# Altium project Venato.PrjPcb (part 2 of 3)
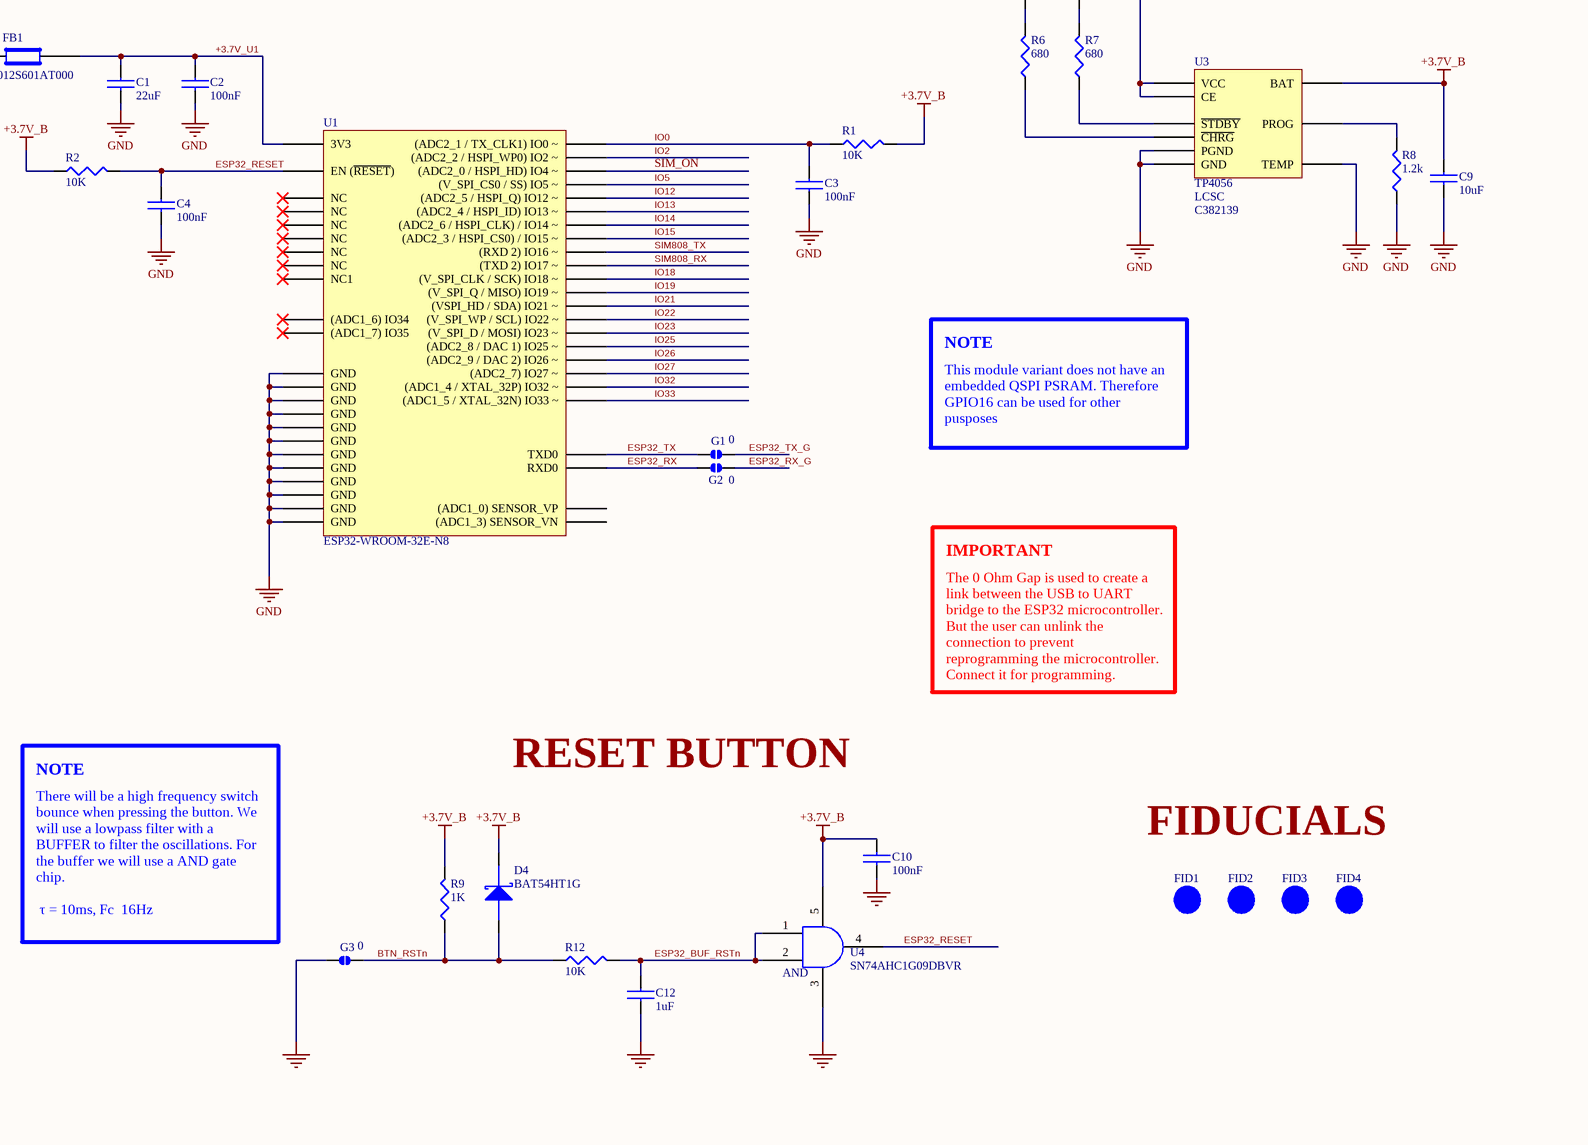
[diagram p4: Venato_Schematic_v1.SchDoc, bottom right]

## Sheet Venato_Schematic_v1.SchDoc (continued)
### Library data of the parts
ANT1 ANT2 = W3043: Antenna Ceramic Monopole 4dB Gain 2483.5MHz SMD; Manufacturer: Pulse; Max Frequency: 2.4835GHz; Number of Bands: 2; Return Loss: -12dB; Impedance: 50R; Manufacturer Part Number: W3043; RoHS: Yes; Category: RF Antennas; Stock 1: 1794; Pricing 1: 1=1.59000, 10=1.43100, 25=1.35000, 100=1.15020, 250=1.08000, 500=0.94500, 1000=0.78300 (USD); Mount: Surface Mount; Case/Package: SMD/SMT; Min Operating Temperature: -40°C; Max Operating Temperature: 85°C; Packaging: Bulk; Package Quantity: 3000; Termination: Solder; Resistor Type: Ceramic; Length: 1.6mm; Width: 3.2mm; Height: 0.043inch; ComponentLink1URL: https://datasheet.ciiva.com/8153/+w3043-8153043.pdf?src-supplier=Avnet; ComponentLink1Description: https://datasheet.ciiva.com/8153/+w3043-8153043.pdf?src-supplier=Avnet; ComponentLink2URL: https://datasheet.ciiva.com/15329/268317-15329727.pdf?src-supplier=Mouser; ComponentLink2Description: https://datasheet.ciiva.com/15329/268317-15329727.pdf?src-supplier=Mouser; ComponentLink3URL: https://datasheet.ciiva.com/2792/+w3043-2792612.pdf?src-supplier=Digi-Key; ComponentLink3Description: https://datasheet.ciiva.com/2792/+w3043-2792612.pdf?src-supplier=Digi-Key; Supplier 1: Digi-Key; Supplier Part Number 1: 553-W3043CT-ND
B1 = SMD-8503-3627-16: SMD Buzzers ROHS; Manufacturer: S&S; Manufacturer Part Number: SMD-8503-3627-16; Category: Uncategorized; Stock 1: 10938; Pricing 1: 1=0.32810, 10=0.26310, 30=0.23430, 100=0.19950, 500=0.18440, 1000=0.17540 (USD); Supplier 1: LCSC; Supplier Part Number 1: C2685545
BA0017 = BA0017: 3.7V 1200mAh Lipo Battery. Dimension: 40.0±3.0mm x 30.0±2.0mm 8.0±0.5mm (1.575±0.118" x 1.181±0.079" x 0.315±0.020")
BAT1 = MY-521-01: Battery button SR521 SMD Battery Connectors ROHS; Manufacturer: MYoung; Manufacturer Part Number: MY-521-01; RoHS: No; Category: Uncategorized; Stock 1: 803; Pricing 1: 1=0.16030, 10=0.13100, 30=0.11850, 100=0.10290, 500=0.09590, 1000=0.09170 (USD); Supplier 1: LCSC; Supplier Part Number 1: C964848
C1 = CL21A226MAQNNNE: CAP CER 22UF 25V X5R 0805; Manufacturer: Samsung; Tolerance: 20%; Manufacturer Part Number: CL21A226MAQNNNE; RoHS: Yes; Category: Ceramic Capacitors; Stock 1: 1815620; Pricing 1: 20=0.02360, 200=0.01840, 600=0.01610, 2000=0.01440, 10000=0.01370, 20000=0.01320 (USD); Mount: Surface Mount; Case/Package: 0805; Case Code (Metric): 2012; Case Code (Imperial): 0805; Contact Plating: Tin; Min Operating Temperature: -55°C; Max Operating Temperature: 85°C; Package Quantity: 1; Packaging: Tape and Reel; Capacitance: 22uF; Voltage Rating: 25V; Dielectric: X5R; Termination: Wraparound; Series: CL; Construction: Flat; Length: 2mm; Width: 0.049inch; Thickness: 0.055inch; Depth: 1.25mm; RoHS Compliant: Yes; ComponentLink1URL: https://datasheet.ciiva.com/25724/cl21a226maqnnne-25724468.pdf?src-supplier=Digi-Key; ComponentLink1Description: https://datasheet.ciiva.com/25724/cl21a226maqnnne-25724468.pdf?src-supplier=Digi-Key; Supplier 1: LCSC; Supplier Part Number 1: C45783
C2-C5 C10 C11 C14 C18 C20 C21 C24-C27 = CGA4J2X7R1H104K125AM: Cap Ceramic 0.1uF 50V X7R 10% Pad SMD 0805 125°C Automotive T/R; Manufacturer: TDK; Supplier 1: Digi-Key; Manufacturer Part Number: CGA4J2X7R1H104K125AM; RoHS: Yes; Category: Ceramic Capacitors; Stock 1: 4940; Pricing 1: 1=0.20000, 10=0.14200, 50=0.08080, 100=0.06700, 500=0.04696, 1000=0.03888 (USD); Mount: Surface Mount; Case/Package: 0805; Case Code (Metric): 2012; Case Code (Imperial): 0805; Weight: 0.000194oz; Min Operating Temperature: -55°C; Max Operating Temperature: 125°C; Capacitance: 100nF; Voltage Rating: 50V; Tolerance: 10%; Packaging: Tape and Reel; Termination: SMD/SMT; Series: CGA; Package Quantity: 1; Voltage Rating (DC): 50V; Dielectric: X7R; Resistor Type: Ceramic; Features: Soft Termination; Length: 0.079inch; Width: 0.049inch; Height: 1.25mm; Thickness: 0.057inch; Depth: 1.25mm; Ratings: AEC-Q200; RoHS Compliant: Yes; ComponentLink1URL: http://components.arrow.com/part/dataview/0323_06888403?src-supplier=Arrow+Europe; ComponentLink1Description: http://components.arrow.com/part/dataview/0323_06888403?src-supplier=Arrow+Europe; ComponentLink2URL: https://product.tdk.com/info/en/catalog/datasheets/mlcc_automotive_openmode_en.pdf?src-supplier=Digi-Key; ComponentLink2Description: https://product.tdk.com/info/en/catalog/datasheets/mlcc_automotive_openmode_en.pdf?src-supplier=Digi-Key; ComponentLink3URL: https://product.tdk.com/info/en/documents/chara_sheet/CGA4J2X7R1H104K125AM.pdf?src-supplier=Digi-Key; ComponentLink3Description: https://product.tdk.com/info/en/documents/chara_sheet/CGA4J2X7R1H104K125AM.pdf?src-supplier=Digi-Key; ComponentLink4URL: http://components.arrow.com/part/dataview/57437351S460182N1165?src-supplier=Arrow+Electronics; ComponentLink4Description: http://components.arrow.com/part/dataview/57437351S460182N1165?src-supplier=Arrow+Electronics; Supplier Part Number 1: 445-6958-1-ND
C6 = GRM21BR71H105KA12L: 0805 1 uF 50 V ±10% Tolerance X7R Multilayer Ceramic Chip Capacitor; Manufacturer: Murata; Voltage Rating: 50V; Supplier 1: Newark; Manufacturer Part Number: GRM21BR71H105KA12L; RoHS: Yes; Category: Ceramic Capacitors; Pricing 1: 1=0.72300, 25=0.64900, 50=0.59100, 100=0.52300, 250=0.46500, 500=0.39900, 1000=0.35100, 2500=0.27800, 3000=0.27800 (USD); Mount: Surface Mount; Case/Package: 0805; Number of Pins: 2; Case Code (Metric): 2012; Case Code (Imperial): 0805; Material: Ceramic; Min Operating Temperature: -55°C; Max Operating Temperature: 125°C; Capacitance: 1uF; Tolerance: 10%; Packaging: Tape and Reel; Package Quantity: 1; Voltage Rating (DC): 50V; Termination: SMD/SMT; Series: GRM; Dielectric: X7R; Construction: Flat; Voltage: 50V; Length: 2mm; Width: 0.049inch; Height: 1.25mm; Depth: 1.25mm; Thickness: 0.053inch; Radiation Hardening: No; RoHS Compliant: Yes; Reach SVHC Compliant: Yes; Lead Free: Lead Free; ComponentLink1URL: https://datasheet.ciiva.com/22774/1747475-22774409.pdf?src-supplier=Farnell; ComponentLink1Description: https://datasheet.ciiva.com/22774/1747475-22774409.pdf?src-supplier=Farnell; ComponentLink2URL: https://datasheet.ciiva.com/28659/1684872-28659460.pdf?src-supplier=Element14; ComponentLink2Description: https://datasheet.ciiva.com/28659/1684872-28659460.pdf?src-supplier=Element14; ComponentLink3URL: https://datasheet.ciiva.com/139/grm21br71h105ka12-139467.pdf?src-supplier=Digi-Key; ComponentLink3Description: https://datasheet.ciiva.com/139/grm21br71h105ka12-139467.pdf?src-supplier=Digi-Key; ComponentLink4URL: https://datasheet.ciiva.com/3777/8166grm21br71h105ka1223-3777308.pdf?src-supplier=Arrow+Electronics; ComponentLink4Description: https://datasheet.ciiva.com/3777/8166grm21br71h105ka1223-3777308.pdf?src-supplier=Arrow+Electronics; ComponentLink5URL: https://datasheet.ciiva.com/29202/450841-da-01-de-vs-chip-kond-0805-1-0-uf-10pr-50-0v-x7r-29202833.pdf?src-supplier=Conrad; ComponentLink5Description: https://datasheet.ciiva.com/29202/450841-da-01-de-vs-chip-kond-0805-1-0-uf-10pr-50-0v-x7r-29202833.pdf?src-supplier=Conrad; ComponentLink6URL: https://datasheet.ciiva.com/29199/454791-da-01-en-vs-kondensator-0805-29199539.pdf?src-supplier=Conrad; ComponentLink6Description: https://datasheet.ciiva.com/29199/454791-da-01-en-vs-kondensator-0805-29199539.pdf?src-supplier=Conrad; ComponentLink7URL: https://datasheet.ciiva.com/22774/608985-22774412.pdf?src-supplier=Farnell; ComponentLink7Description: https://datasheet.ciiva.com/22774/608985-22774412.pdf?src-supplier=Farnell; ComponentLink8URL: https://datasheet.ciiva.com/22774/608985-22774411.pdf?src-supplier=Farnell; ComponentLink8Description: https://datasheet.ciiva.com/22774/608985-22774411.pdf?src-supplier=Farnell; ComponentLink9URL: https://datasheet.ciiva.com/16199/product-16199127.pdf?src-supplier=Future+Electronics; ComponentLink9Description: https://datasheet.ciiva.com/16199/product-16199127.pdf?src-supplier=Future+Electronics
C7 C22 C23 = GRM21BR60J107ME15L: 0805 100 uF 6.3 V ±20% Tolerance X5R Multilayer Ceramic Chip Capacitor; Manufacturer: Murata; Voltage Rating: 6.3V; Manufacturer Part Number: GRM21BR60J107ME15L; RoHS: Yes; Category: Ceramic Capacitors; Stock 1: 830718; Pricing 1: 1=1.15000, 10=0.90900, 50=0.78800, 100=0.68180, 500=0.51516, 1000=0.45456 (USD); Mount: Surface Mount; Case/Package: 0805; Case Code (Metric): 2012; Case Code (Imperial): 0805; Min Operating Temperature: -55°C; Max Operating Temperature: 85°C; Packaging: Cut Tape; Dielectric: X5R; Tolerance: 20%; Voltage Rating (DC): 6.3V; Capacitance: 100uF; Series: GRM; Length: 0.079inch; Width: 0.049inch; Thickness: 0.057inch; Reach SVHC Compliant: Yes; Lead Free: Lead Free; RoHS Compliant: Yes; ComponentLink1URL: http://www.farnell.com/datasheets/1957830.pdf?src-supplier=Farnell; ComponentLink1Description: http://www.farnell.com/datasheets/1957830.pdf?src-supplier=Farnell; ComponentLink2URL: http://www.farnell.com/datasheets/1957830.pdf?src-supplier=Element14; ComponentLink2Description: http://www.farnell.com/datasheets/1957830.pdf?src-supplier=Element14; ComponentLink3URL: https://search.murata.co.jp/Ceramy/image/img/A01X/G101/ENG/GRM21BR60J107ME15-01.pdf?src-supplier=Digi-Key; ComponentLink3Description: https://search.murata.co.jp/Ceramy/image/img/A01X/G101/ENG/GRM21BR60J107ME15-01.pdf?src-supplier=Digi-Key; ComponentLink4URL: http://www.farnell.com/datasheets/1957830.pdf?src-supplier=Newark; ComponentLink4Description: http://www.farnell.com/datasheets/1957830.pdf?src-supplier=Newark; Supplier 1: Digi-Key; Supplier Part Number 1: 490-13981-1-ND
C8 C12 C13 = C2012X5R1E105K125AA: TDK - C2012X5R1E105K125AA - SMD Multilayer Ceramic Capacitor, 1 µF, 25 V, 0805 [2012 Metric], ± 10%, X5R, C Series; Voltage Rating: 25V; Supplier 1: Digi-Key; Manufacturer: TDK; Manufacturer Part Number: C2012X5R1E105K125AA; RoHS: Yes; Category: Ceramic Capacitors; Stock 1: 32247; Pricing 1: 1=0.23000, 10=0.15800, 50=0.09500, 100=0.08030, 500=0.05492, 1000=0.04858 (USD); Mount: Surface Mount; Case/Package: 0805; Number of Pins: 2; Case Code (Metric): 2012; Case Code (Imperial): 0805; Dielectric Material: Ceramic; Weight: 0.000194oz; Min Operating Temperature: -55°C; Max Operating Temperature: 85°C; Tolerance: 10%; Capacitance: 1uF; Packaging: Tape and Reel; Voltage Rating (DC): 25V; Dielectric: X5R; Termination: SMD/SMT; Construction: Flat; Package Quantity: 2000; Resistor Type: Ceramic; Voltage: 25V; Series: C; Length: 2mm; Width: 0.049inch; Height: 1.25mm; Depth: 1.25mm; Thickness: 0.057inch; Radiation Hardening: No; Lead Free: Lead Free; RoHS Compliant: Yes; REACH SVHC: No SVHC; ComponentLink1URL: https://datasheet.ciiva.com/11787/0900766b80c1bb00-11787608.pdf?src-supplier=RSComponents; ComponentLink1Description: https://datasheet.ciiva.com/11787/0900766b80c1bb00-11787608.pdf?src-supplier=RSComponents; ComponentLink2URL: https://datasheet.ciiva.com/16449/e412-c-16449595.pdf?src-supplier=Future+Electronics; ComponentLink2Description: https://datasheet.ciiva.com/16449/e412-c-16449595.pdf?src-supplier=Future+Electronics; ComponentLink3URL: https://datasheet.ciiva.com/28602/1744655-28602171.pdf?src-supplier=Element14; ComponentLink3Description: https://datasheet.ciiva.com/28602/1744655-28602171.pdf?src-supplier=Element14; ComponentLink4URL: https://datasheet.ciiva.com/15192/getdatasheetpartid-726707-15192140.pdf?src-supplier=Verical; ComponentLink4Description: https://datasheet.ciiva.com/15192/getdatasheetpartid-726707-15192140.pdf?src-supplier=Verical; Supplier Part Number 1: 445-1419-1-ND
C9 C19 = CGA4J3X7S1A106M125AB: Cap Ceramic 10uF 10V X7S 20% Pad SMD 0805 125°C Low ESR Automotive T/R; Manufacturer: TDK; Manufacturer Part Number: CGA4J3X7S1A106M125AB; RoHS: Yes; Category: Ceramic Capacitors; Mount: Surface Mount; Case/Package: 0805; Case Code (Metric): 2012; Case Code (Imperial): 0805; Weight: 0.000194oz; Min Operating Temperature: -55°C; Max Operating Temperature: 125°C; Packaging: Tape and Reel; Capacitance: 10uF; Voltage Rating: 10V; Tolerance: 20%; Dielectric: X7S; Termination: SMD/SMT; Voltage Rating (DC): 10V; Package Quantity: 2000; Length: 0.079inch; Width: 1.25mm; Height: 1.25mm; Thickness: 0.057inch; Ratings: AEC-Q200; RoHS Compliant: Yes; ComponentLink1URL: http://www.mouser.com/ds/2/400/lcc_automotive_general_en-843974.pdf?src-supplier=Mouser; ComponentLink1Description: http://www.mouser.com/ds/2/400/lcc_automotive_general_en-843974.pdf?src-supplier=Mouser; ComponentLink2URL: https://product.tdk.com/info/en/documents/chara_sheet/CGA4J3X7S1A106M125AB.pdf?src-supplier=Digi-Key; ComponentLink2Description: https://product.tdk.com/info/en/documents/chara_sheet/CGA4J3X7S1A106M125AB.pdf?src-supplier=Digi-Key; Supplier 1: Digi-Key; Supplier Part Number 1: 445-16115-1-ND
  C9: Stock 1: 13960; Pricing 1: 1=0.41000, 10=0.29000, 50=0.21920, 100=0.19090, 500=0.14140, 1000=0.12019 (USD)
  C19: Stock 1: 10; Pricing 1: 1=0.45000, 10=0.31600, 50=0.23880, 100=0.20790, 500=0.15400, 1000=0.13090 (USD)
C15-C17 = CC0805JRNPO9BN330: Cap Ceramic 33pF 50V C0G 5% SMD 0805 125C T/R; Manufacturer: Yageo; Manufacturer Part Number: CC0805JRNPO9BN330; RoHS: Yes; Category: Ceramic Capacitors; Stock 1: 150073; Pricing 1: 1=0.10000, 10=0.06900, 50=0.03760, 100=0.03060, 500=0.02188, 1000=0.01719 (USD); Mount: Surface Mount; Case/Package: 0805; Material: Ceramic; Case Code (Imperial): 0805; Case Code (Metric): 2012; Dielectric Material: Ceramic; Min Operating Temperature: -55°C; Max Operating Temperature: 125°C; Capacitance: 33pF; Tolerance: 5%; Dielectric: C0G; Voltage: 50V; Series: CC; Package Quantity: 1; Voltage Rating: 50V; Voltage Rating (DC): 50V; Packaging: Tape and Reel; Termination: SMD/SMT; Resistor Type: Ceramic; Length: 2mm; Width: 0.049inch; Height: 0.6mm; Depth: 1.25mm; Thickness: 0.024inch; Radiation Hardening: No; Lead Free: Lead Free; RoHS Compliant: Yes; ComponentLink1URL: https://datasheet.ciiva.com/8033/1443161-8033944.pdf?src-supplier=Element14; ComponentLink1Description: https://datasheet.ciiva.com/8033/1443161-8033944.pdf?src-supplier=Element14; ComponentLink2URL: https://datasheet.ciiva.com/8033/1443161-8033942.pdf?src-supplier=Element14; ComponentLink2Description: https://datasheet.ciiva.com/8033/1443161-8033942.pdf?src-supplier=Element14; ComponentLink3URL: https://datasheet.ciiva.com/144/mlccorderingcode-144779.pdf?src-supplier=Digi-Key; ComponentLink3Description: https://datasheet.ciiva.com/144/mlccorderingcode-144779.pdf?src-supplier=Digi-Key; ComponentLink4URL: https://datasheet.ciiva.com/144/mlccorderingcode-144778.pdf?src-supplier=Digi-Key; ComponentLink4Description: https://datasheet.ciiva.com/144/mlccorderingcode-144778.pdf?src-supplier=Digi-Key; ComponentLink5URL: https://datasheet.ciiva.com/144/mlccorderingcode-144780.pdf?src-supplier=Digi-Key; ComponentLink5Description: https://datasheet.ciiva.com/144/mlccorderingcode-144780.pdf?src-supplier=Digi-Key; ComponentLink6URL: https://datasheet.ciiva.com/11464/upy-gp-np0-16v-to-50v-8-11464747.pdf?src-supplier=Avnet; ComponentLink6Description: https://datasheet.ciiva.com/11464/upy-gp-np0-16v-to-50v-8-11464747.pdf?src-supplier=Avnet; ComponentLink7URL: https://datasheet.ciiva.com/29241/445349-da-01-en-kerko-chip-0805-np0-33pf-5proz-50v-g-29241975.pdf?src-supplier=Conrad; ComponentLink7Description: https://datasheet.ciiva.com/29241/445349-da-01-en-kerko-chip-0805-np0-33pf-5proz-50v-g-29241975.pdf?src-supplier=Conrad; Supplier 1: Digi-Key; Supplier Part Number 1: 311-1105-1-ND
D1 D8 D9 = LGL29K-G2J1-24-Z: LED Single Chip Green 570nm 20mA 2-Pin 0603 T/R; Manufacturer: Osram Opto; Lens Color: White; Forward Voltage: 2.2V; Luminous Intensity: 5.6mcd; Viewing Angle: 160°; Lens Style: Flat,Diffused,Colorless,Rectangular; Test Current: 2mA; Luminous Flux: 0.012lm; Number of LEDs: 1; Lens Transparency: Diffused; Reverse Voltage: 12V; Lens Size: 0.8mm; Supplier 1: Bison Technologies; Manufacturer Part Number: LGL29K-G2J1-24-Z; RoHS: Yes; Category: LEDs; Stock 1: 60000; Mount: Surface Mount; Case/Package: 0603; Number of Pins: 2; Color: Green; Case Code (Metric): 1608; Case Code (Imperial): 0603; Min Operating Temperature: -40°C; Max Operating Temperature: 100°C; Illumination Color: Green; Forward Current: 20mA; Packaging: Tape and Reel; Package Quantity: 5000; Dominant Wavelength: 570nm; Number of Elements: 1; Series: SmartLED; Length: 1.3mm; Width: 0.8mm; Height: 0.65mm; Depth: 0.8mm; Radiation Hardening: No; RoHS Compliant: Yes; ComponentLink1URL: https://datasheet.ciiva.com/4689/g-l29k-39844-4689584.pdf?src-supplier=Mouser; ComponentLink1Description: https://datasheet.ciiva.com/4689/g-l29k-39844-4689584.pdf?src-supplier=Mouser; ComponentLink2URL: https://datasheet.ciiva.com/15198/getdatasheetpartid-571127-15198411.pdf?src-supplier=Verical; ComponentLink2Description: https://datasheet.ciiva.com/15198/getdatasheetpartid-571127-15198411.pdf?src-supplier=Verical; ComponentLink3URL: https://datasheet.ciiva.com/2112/00077107-0-2112887.pdf?src-supplier=Digi-Key; ComponentLink3Description: https://datasheet.ciiva.com/2112/00077107-0-2112887.pdf?src-supplier=Digi-Key; ComponentLink4URL: https://datasheet.ciiva.com/2112/00077107-0-2112886.pdf?src-supplier=Digi-Key; ComponentLink4Description: https://datasheet.ciiva.com/2112/00077107-0-2112886.pdf?src-supplier=Digi-Key; ComponentLink5URL: https://datasheet.ciiva.com/2112/00077107-0-2112888.pdf?src-supplier=Digi-Key; ComponentLink5Description: https://datasheet.ciiva.com/2112/00077107-0-2112888.pdf?src-supplier=Digi-Key; Supplier Part Number 1: LGL29K-G2J1-24-Z-299157-OSRAMOPTO
D2 D5 D6 = LOL29K-H2K1-24-Z: Smartled Orange Lc; Manufacturer: Osram Opto; Lens Color: White; Forward Current: 20mA; Forward Voltage: 2.2V; Luminous Intensity: 9mcd; Viewing Angle: 160°; Lens Style: Flat,Diffused,Colorless,Rectangular; Test Current: 2mA; Dominant Wavelength: 606nm; Luminous Flux: 0.025lm; Number of LEDs: 1; Lens Transparency: Diffused; Reverse Voltage: 12V; Lens Size: 0.8mm; Supplier 1: Arrow Electronics; Manufacturer Part Number: LOL29K-H2K1-24-Z; RoHS: Yes; Category: Uncategorized; Mount: Surface Mount; Case/Package: 0603; Number of Pins: 2; Color: Orange; Case Code (Metric): 1608; Case Code (Imperial): 0603; Min Operating Temperature: -40°C; Max Operating Temperature: 100°C; Illumination Color: Orange; Packaging: Tape and Reel; Package Quantity: 5000; Number of Elements: 1; Series: SmartLED; Length: 1.3mm; Width: 0.8mm; Height: 0.65mm; Depth: 0.8mm; Radiation Hardening: No; RoHS Compliant: Yes; ComponentLink1URL: https://datasheet.ciiva.com/2112/00077105-0-2112905.pdf?src-supplier=Digi-Key; ComponentLink1Description: https://datasheet.ciiva.com/2112/00077105-0-2112905.pdf?src-supplier=Digi-Key; ComponentLink2URL: https://datasheet.ciiva.com/2112/00077105-0-2112904.pdf?src-supplier=Digi-Key; ComponentLink2Description: https://datasheet.ciiva.com/2112/00077105-0-2112904.pdf?src-supplier=Digi-Key; ComponentLink3URL: https://datasheet.ciiva.com/2112/00077105-0-2112906.pdf?src-supplier=Digi-Key; ComponentLink3Description: https://datasheet.ciiva.com/2112/00077105-0-2112906.pdf?src-supplier=Digi-Key; ComponentLink4URL: https://datasheet.ciiva.com/15198/getdatasheetpartid-693885-15198412.pdf?src-supplier=Verical; ComponentLink4Description: https://datasheet.ciiva.com/15198/getdatasheetpartid-693885-15198412.pdf?src-supplier=Verical; Supplier Part Number 1: LO L29K-H2K1-24-Z
D3 = BZT52C5V1S: Zener Single Diode, 5.1 V, 200 Mw, Sod-323, 6 %, 2, 150 C Rohs Compliant: Yes; Manufacturer: Multicomp; Max Power Dissipation: 200mW; Test Current: 5mA; Forward Voltage: 900mV; Max Forward Surge Current (Ifsm): 2A; Supplier 1: Farnell; Manufacturer Part Number: BZT52C5V1S; RoHS: Yes; Category: Zener Diodes; Mount: Surface Mount; Number of Pins: 2; Min Operating Temperature: -65°C; Max Operating Temperature: 150°C; Zener Voltage: 5.1V; Packaging: Cut Tape; Termination: SMD/SMT; Reach SVHC Compliant: Yes; ComponentLink1URL: http://www.farnell.com/datasheets/469132.pdf?src-supplier=Farnell; ComponentLink1Description: http://www.farnell.com/datasheets/469132.pdf?src-supplier=Farnell; ComponentLink2URL: http://www.farnell.com/datasheets/469132.pdf?src-supplier=Element14; ComponentLink2Description: http://www.farnell.com/datasheets/469132.pdf?src-supplier=Element14; Supplier Part Number 1: 1466019
D4 = BAT54HT1G: Small Signal Schottky Diode, Single, 30 V, 200 Ma, 800 Mv, 600 Ma, 150 C; Manufacturer: ON Semiconductor / Fairchild; Forward Voltage: 800mV; Forward Current: 200mA; Recovery Time: 5ns; Max Repetitive Reverse Voltage (Vrrm): 30V; Peak Non-Repetitive Surge Current: 600mA; Max Reverse Current: 2uA; Power Dissipation: 200mW; Polarity: Standard; Capacitance: 10pF; Supplier 1: Digi-Key; Manufacturer Part Number: BAT54HT1G; RoHS: Yes; Category: Schottky Diodes; Pricing 1: 1=0.24000, 10=0.19900, 100=0.10570, 500=0.06956, 1000=0.04730 (USD); Mount: Surface Mount; Number of Pins: 2; Contact Plating: Tin,Matte; Min Operating Temperature: -55°C; Max Operating Temperature: 150°C; Packaging: Tape and Reel; Package Quantity: 3000; Average Rectified Current: 200mA; Reverse Recovery Time: 5ns; Max Forward Surge Current (Ifsm): 600mA; Element Configuration: Single; Max Reverse Voltage (DC): 30V; Max Surge Current: 600mA; Voltage Rating (DC): 30V; Current Rating: 200mA; Output Current: 200mA; Reverse Voltage: 30V; Max Reverse Leakage Current: 2uA; Length: 1.8mm; Width: 1.35mm; Height: 1mm; Radiation Hardening: No; Lead Free: Lead Free; REACH SVHC: No SVHC; RoHS Compliant: Yes; ComponentLink1URL: https://datasheet.ciiva.com/4714/bat54ht1-d-72881-4714706.pdf?src-supplier=Mouser; ComponentLink1Description: https://datasheet.ciiva.com/4714/bat54ht1-d-72881-4714706.pdf?src-supplier=Mouser; ComponentLink2URL: https://datasheet.ciiva.com/4452/bat54ht1g-104602-4452889.pdf?src-supplier=Mouser; ComponentLink2Description: https://datasheet.ciiva.com/4452/bat54ht1g-104602-4452889.pdf?src-supplier=Mouser; ComponentLink3URL: https://datasheet.ciiva.com/30479/0900766b811a63a9-30479442.pdf?src-supplier=RSComponents; ComponentLink3Description: https://datasheet.ciiva.com/30479/0900766b811a63a9-30479442.pdf?src-supplier=RSComponents; ComponentLink4URL: https://datasheet.ciiva.com/34301/806549-34301562.pdf?src-supplier=Jameco; ComponentLink4Description: https://datasheet.ciiva.com/34301/806549-34301562.pdf?src-supplier=Jameco; ComponentLink5URL: https://datasheet.ciiva.com/1240/1747983-1240762.pdf?src-supplier=Newark; ComponentLink5Description: https://datasheet.ciiva.com/1240/1747983-1240762.pdf?src-supplier=Newark; ComponentLink6URL: https://datasheet.ciiva.com/915/bat54ht1-d-915445.pdf?src-supplier=Digi-Key; ComponentLink6Description: https://datasheet.ciiva.com/915/bat54ht1-d-915445.pdf?src-supplier=Digi-Key; ComponentLink7URL: https://datasheet.ciiva.com/915/bat54ht1-d-915444.pdf?src-supplier=Digi-Key; ComponentLink7Description: https://datasheet.ciiva.com/915/bat54ht1-d-915444.pdf?src-supplier=Digi-Key; ComponentLink8URL: https://datasheet.ciiva.com/910/bat54ht1g-910499.pdf?src-supplier=Digi-Key; ComponentLink8Description: https://datasheet.ciiva.com/910/bat54ht1g-910499.pdf?src-supplier=Digi-Key; ComponentLink9URL: https://datasheet.ciiva.com/910/bat54ht1g-910498.pdf?src-supplier=Digi-Key; ComponentLink9Description: https://datasheet.ciiva.com/910/bat54ht1g-910498.pdf?src-supplier=Digi-Key; ComponentLink10URL: https://datasheet.ciiva.com/8294/bat54ht1-d-8294645.pdf?src-supplier=Avnet; ComponentLink10Description: https://datasheet.ciiva.com/8294/bat54ht1-d-8294645.pdf?src-supplier=Avnet; ComponentLink11URL: https://datasheet.ciiva.com/910/bat54ht1g-910497.pdf?src-supplier=Digi-Key; ComponentLink11Description: https://datasheet.ciiva.com/910/bat54ht1g-910497.pdf?src-supplier=Digi-Key; ComponentLink12URL: https://datasheet.ciiva.com/8303/bat54ht1g-8303645.pdf?src-supplier=Avnet; ComponentLink12Description: https://datasheet.ciiva.com/8303/bat54ht1g-8303645.pdf?src-supplier=Avnet; ComponentLink13URL: https://datasheet.ciiva.com/915/bat54ht1-d-915443.pdf?src-supplier=Digi-Key; ComponentLink13Description: https://datasheet.ciiva.com/915/bat54ht1-d-915443.pdf?src-supplier=Digi-Key; ComponentLink14URL: https://datasheet.ciiva.com/46429/1727620-46429206.pdf?src-supplier=Element14; ComponentLink14Description: https://datasheet.ciiva.com/46429/1727620-46429206.pdf?src-supplier=Element14; ComponentLink15URL: https://datasheet.ciiva.com/1180/bat54ht1-d-1180252.pdf?src-supplier=Element14; ComponentLink15Description: https://datasheet.ciiva.com/1180/bat54ht1-d-1180252.pdf?src-supplier=Element14; ComponentLink16URL: https://datasheet.ciiva.com/1180/bat54ht1-d-1180251.pdf?src-supplier=Element14; ComponentLink16Description: https://datasheet.ciiva.com/1180/bat54ht1-d-1180251.pdf?src-supplier=Element14; ComponentLink17URL: https://datasheet.ciiva.com/17020/bat54ht1g-17020445.pdf?src-supplier=Future+Electronics; ComponentLink17Description: https://datasheet.ciiva.com/17020/bat54ht1g-17020445.pdf?src-supplier=Future+Electronics; ComponentLink18URL: https://datasheet.ciiva.com/48686/001262925-da-01-en-diode-schottky-30v-bat54ht1g-sod-323-fsc-48686266.pdf?src-supplier=Conrad; ComponentLink18Description: https://datasheet.ciiva.com/48686/001262925-da-01-en-diode-schottky-30v-bat54ht1g-sod-323-fsc-48686266.pdf?src-supplier=Conrad; Supplier Part Number 1: BAT54HT1GOSDKR-ND
D7 = RB160M-30TR: DIODE SCHOTTKY 30V 1A PMDU; Manufacturer: Rohm; Max Surge Current: 30A; Max Reverse Leakage Current: 50uA; Forward Voltage: 430mV; Element Configuration: Single; Polarity: Standard; Manufacturer Part Number: RB160M-30TR; RoHS: Yes; Category: Rectifier Diodes; Stock 1: 1870; Pricing 1: 1=0.39000 (USD); Mount: Surface Mount; Number of Pins: 2; Min Operating Temperature: -40°C; Max Operating Temperature: 125°C; Package Quantity: 1; Packaging: Tape and Reel; Average Rectified Current: 1A; Max Reverse Voltage (DC): 30V; Forward Current: 1A; Max Reverse Current: 50uA; Max Repetitive Reverse Voltage (Vrrm): 30V; Max Forward Surge Current (Ifsm): 30A; Peak Non-Repetitive Surge Current: 30A; Termination: SMD/SMT; Series: -; Voltage Rating (DC): 30V; Current Rating: 1A; Output Current: 1A; Radiation Hardening: No; RoHS Compliant: Yes; Reach SVHC Compliant: Yes; Lead Free: Lead Free; ComponentLink1URL: https://datasheet.ciiva.com/22696/24622-22696102.pdf?src-supplier=Element14; ComponentLink1Description: https://datasheet.ciiva.com/22696/24622-22696102.pdf?src-supplier=Element14; ComponentLink2URL: https://datasheet.ciiva.com/13083/rb160m-30-210354-13083762.pdf?src-supplier=Mouser; ComponentLink2Description: https://datasheet.ciiva.com/13083/rb160m-30-210354-13083762.pdf?src-supplier=Mouser; ComponentLink3URL: https://datasheet.ciiva.com/913/rb160m-30-913552.pdf?src-supplier=Digi-Key; ComponentLink3Description: https://datasheet.ciiva.com/913/rb160m-30-913552.pdf?src-supplier=Digi-Key; ComponentLink4URL: https://datasheet.ciiva.com/16208/rb160m-30-16208896.pdf?src-supplier=Future+Electronics; ComponentLink4Description: https://datasheet.ciiva.com/16208/rb160m-30-16208896.pdf?src-supplier=Future+Electronics; ComponentLink5URL: https://datasheet.ciiva.com/7624/24622-7624621.pdf?src-supplier=Element14; ComponentLink5Description: https://datasheet.ciiva.com/7624/24622-7624621.pdf?src-supplier=Element14; ComponentLink6URL: https://datasheet.ciiva.com/3021/rb160m-30-3021996.pdf?src-supplier=Avnet; ComponentLink6Description: https://datasheet.ciiva.com/3021/rb160m-30-3021996.pdf?src-supplier=Avnet
EC1 = EdgeCard
FB1 FB2 = MPZ2012S601AT000: Ferrite Beads Multi-Layer Power 600Ohm 25% 100MHz 2A 100mOhm DCR 0805 T/R; Manufacturer: TDK; Impedance: 600R; DC Resistance (DCR): 100mR; Supplier 1: Digi-Key; Manufacturer Part Number: MPZ2012S601AT000; RoHS: Yes; Category: Ferrite Beads and Chips; Pricing 1: 1=0.12000, 10=0.10100, 25=0.09040, 50=0.06640, 100=0.05740, 250=0.04528, 500=0.03824, 1000=0.03221 (USD); Mount: Surface Mount; Case/Package: 0805; Case Code (Metric): 2012; Case Code (Imperial): 0805; Packaging: Tape and Reel; Package Quantity: 1; Current Rating: 2A; Max DC Current: 2A; Series: MPZ; Length: 0.079inch; Width: 0.049inch; Height: 0.041inch; REACH SVHC: No SVHC; Lead Free: Lead Free; RoHS Compliant: Yes; ComponentLink1URL: https://datasheet.ciiva.com/46634/beads-commercial-power-mpz-en-46634377.pdf?src-supplier=Digi-Key; ComponentLink1Description: https://datasheet.ciiva.com/46634/beads-commercial-power-mpz-en-46634377.pdf?src-supplier=Digi-Key; ComponentLink2URL: https://datasheet.ciiva.com/46634/beads-commercial-power-mpz-en-46634606.pdf?src-supplier=Digi-Key; ComponentLink2Description: https://datasheet.ciiva.com/46634/beads-commercial-power-mpz-en-46634606.pdf?src-supplier=Digi-Key; ComponentLink3URL: https://datasheet.ciiva.com/46634/beads-commercial-power-mpz-en-46634335.pdf?src-supplier=Digi-Key; ComponentLink3Description: https://datasheet.ciiva.com/46634/beads-commercial-power-mpz-en-46634335.pdf?src-supplier=Digi-Key; Supplier Part Number 1: 445-2206-6-ND
FID1-FID4 = FID_1MM: Fisushal 1MM
G1-G3 = 0Ohm gap: This is a gap that diconects line. you can connect it using soldier
J1 = 78800-0001: Vertical Surface Mount Memory & SIM Card Connector; with SMT Termination; Manufacturer: Molex; Number of Contacts: 6; Connector Type: Socket; Current Rating: 500mA; Gender: Female; Voltage Rating (DC): 5V; Shielding: Shielded; Pitch: 1.4mm; Supplier 1: RSComponents; Manufacturer Part Number: 78800-0001; RoHS: Yes; Category: Memory Connectors; Stock 1: 1295; Pricing 1: 5=1.42600, 25=1.35800, 50=1.28600, 125=1.18000, 250=1.07600 (GBP); Mount: Surface Mount; Contact Material: Bronze; Contact Plating: Gold; Housing Material: Polymer; Material: Bronze; Min Operating Temperature: -30°C; Max Operating Temperature: 85°C; Packaging: Tape and Reel; Series: 78800; Package Quantity: 1200; Termination: SMD/SMT; Number of Rows: 1; Orientation: Vertical; Number of Circuits: 6; Length: 16.96mm; Height: 1.4mm; RoHS Compliant: Yes; Halogen Free: Low Halogen; ELV: Compliant; ComponentLink1URL: https://datasheet.ciiva.com/28461/1769838-28461586.pdf?src-supplier=Element14; ComponentLink1Description: https://datasheet.ciiva.com/28461/1769838-28461586.pdf?src-supplier=Element14; ComponentLink2URL: https://datasheet.ciiva.com/30490/0900766b812787b6-30490685.pdf?src-supplier=RSComponents; ComponentLink2Description: https://datasheet.ciiva.com/30490/0900766b812787b6-30490685.pdf?src-supplier=RSComponents; ComponentLink3URL: https://datasheet.ciiva.com/23829/0788000001-memory-card-socket-23829351.pdf?src-supplier=Newark; ComponentLink3Description: https://datasheet.ciiva.com/23829/0788000001-memory-card-socket-23829351.pdf?src-supplier=Newark; ComponentLink4URL: https://datasheet.ciiva.com/24089/0788000001-memory-card-socket-253493-24089694.pdf?src-supplier=Mouser; ComponentLink4Description: https://datasheet.ciiva.com/24089/0788000001-memory-card-socket-253493-24089694.pdf?src-supplier=Mouser; ComponentLink5URL: https://datasheet.ciiva.com/28461/1769838-28461580.pdf?src-supplier=Element14; ComponentLink5Description: https://datasheet.ciiva.com/28461/1769838-28461580.pdf?src-supplier=Element14
J2 = 10118193-0001LF: FCI Right Angle Surface Mount Mount Female USB Connector; 100 V ac; 1.8A; Manufacturer: Amphenol ICC / FCI; Supplier 1: Digi-Key; Manufacturer Part Number: 10118193-0001LF; RoHS: No; Category: USB Connectors; Stock 1: 101220; Pricing 1: 1=0.48000, 10=0.42000, 25=0.38440, 50=0.36160, 100=0.34660, 250=0.31640, 500=0.30136 (USD); ComponentLink1URL: http://components.arrow.com/part/dataview/0323_04107372?src-supplier=Arrow+Europe; ComponentLink1Description: http://components.arrow.com/part/dataview/0323_04107372?src-supplier=Arrow+Europe; ComponentLink2URL: http://uk.rs-online.com/webdocs/1450/0900766b814507f1.pdf?src-supplier=RSComponents; ComponentLink2Description: http://uk.rs-online.com/webdocs/1450/0900766b814507f1.pdf?src-supplier=RSComponents; ComponentLink3URL: https://cdn.amphenol-icc.com/media/wysiwyg/files/documentation/datasheet/inputoutput/io_usb_micro.pdf?src-supplier=Avnet; ComponentLink3Description: https://cdn.amphenol-icc.com/media/wysiwyg/files/documentation/datasheet/inputoutput/io_usb_micro.pdf?src-supplier=Avnet; ComponentLink4URL: https://cdn.amphenol-icc.com/media/wysiwyg/files/documentation/datasheet/inputoutput/io_usb_micro.pdf?src-supplier=Arrow+Electronics; ComponentLink4Description: https://cdn.amphenol-icc.com/media/wysiwyg/files/documentation/datasheet/inputoutput/io_usb_micro.pdf?src-supplier=Arrow+Electronics; ComponentLink5URL: https://cdn.amphenol-icc.com/media/wysiwyg/files/documentation/datasheet/inputoutput/io_usb_micro.pdf?src-supplier=Onlinecomponents.com; ComponentLink5Description: https://cdn.amphenol-icc.com/media/wysiwyg/files/documentation/datasheet/inputoutput/io_usb_micro.pdf?src-supplier=Onlinecomponents.com; ComponentLink6URL: https://cdn.amphenol-icc.com/media/wysiwyg/files/documentation/datasheet/inputoutput/io_usb_micro.pdf?src-supplier=Verical; ComponentLink6Description: https://cdn.amphenol-icc.com/media/wysiwyg/files/documentation/datasheet/inputoutput/io_usb_micro.pdf?src-supplier=Verical; ComponentLink7URL: http://www.amphenol-icc.com/media/wysiwyg/files/drawing/10118193.pdf?src-supplier=Digi-Key; ComponentLink7Description: http://www.amphenol-icc.com/media/wysiwyg/files/drawing/10118193.pdf?src-supplier=Digi-Key; ComponentLink8URL: https://cdn.amphenol-icc.com/media/wysiwyg/files/documentation/datasheet/inputoutput/io_usb_micro.pdf?src-supplier=Digi-Key; ComponentLink8Description: https://cdn.amphenol-icc.com/media/wysiwyg/files/documentation/datasheet/inputoutput/io_usb_micro.pdf?src-supplier=Digi-Key; ComponentLink9URL: https://cdn.amphenol-icc.com/media/wysiwyg/files/documentation/datasheet/inputoutput/io_usb_micro.pdf?src-supplier=Mouser; ComponentLink9Description: https://cdn.amphenol-icc.com/media/wysiwyg/files/documentation/datasheet/inputoutput/io_usb_micro.pdf?src-supplier=Mouser; ComponentLink10URL: https://cdn.amphenol-icc.com/media/wysiwyg/files/documentation/datasheet/inputoutput/io_usb_micro.pdf?src-supplier=Allied+Electronics; ComponentLink10Description: https://cdn.amphenol-icc.com/media/wysiwyg/files/documentation/datasheet/inputoutput/io_usb_micro.pdf?src-supplier=Allied+Electronics; ComponentLink11URL: https://cdn.amphenol-icc.com/media/wysiwyg/files/documentation/datasheet/inputoutput/io_usb_micro.pdf?src-supplier=RSComponents; ComponentLink11Description: https://cdn.amphenol-icc.com/media/wysiwyg/files/documentation/datasheet/inputoutput/io_usb_micro.pdf?src-supplier=RSComponents; ComponentLink12URL: https://cdn.amphenol-icc.com/media/wysiwyg/files/documentation/datasheet/inputoutput/io_usb_micro.pdf?src-supplier=TTI; ComponentLink12Description: https://cdn.amphenol-icc.com/media/wysiwyg/files/documentation/datasheet/inputoutput/io_usb_micro.pdf?src-supplier=TTI; ComponentLink13URL: https://cdn.amphenol-icc.com/media/wysiwyg/files/documentation/datasheet/inputoutput/io_usb_micro.pdf?src-supplier=TME; ComponentLink13Description: https://cdn.amphenol-icc.com/media/wysiwyg/files/documentation/datasheet/inputoutput/io_usb_micro.pdf?src-supplier=TME; ComponentLink14URL: https://cdn.amphenol-icc.com/media/wysiwyg/files/documentation/datasheet/inputoutput/io_usb_micro.pdf?src-supplier=Heilind+Electronics; ComponentLink14Description: https://cdn.amphenol-icc.com/media/wysiwyg/files/documentation/datasheet/inputoutput/io_usb_micro.pdf?src-supplier=Heilind+Electronics; Supplier Part Number 1: 609-4616-1-ND
J3 J4 = Ipex: SMD RF Connectors / Coaxial Connectors ROHS; ComponentLink1Description: New link; ComponentLink1URL: *
L1 = L1210R2R2MDWIT: Inductor RF Chip Wirewound 2.2uH 20% 100KHz 1.13A 0.104Ohm DCR 1210 T/R; Manufacturer: KEMET; Core Material: Ferrite; Max DC Current: 2A; Shielding: Unshielded; Self Resonant Frequency: 190MHz; DC Resistance (DCR): 80mR; Supplier 1: Digi-Key; Manufacturer Part Number: L1210R2R2MDWIT; RoHS: Yes; Category: Fixed Inductors; Stock 1: 11928; Pricing 1: 1=0.50000, 10=0.43700, 25=0.40600, 50=0.34360, 100=0.31240, 250=0.29364, 500=0.26240 (USD); Mount: Surface Mount; Case/Package: 1210; Case Code (Metric): 3225; Case Code (Imperial): 1210; Min Operating Temperature: -40°C; Max Operating Temperature: 105°C; Tolerance: 20%; Inductance: 2.2uH; Package Quantity: 1000; Current Rating: 2A; Packaging: Tape and Reel; Inductance Tolerance: 20%; Resistor Type: Wirewound,Ceramic; Test Frequency: 100kHz; Termination: SMD/SMT; DC Current: 1.13A; Series: L-DWI; Length: 0.126inch; Width: 0.098inch; Height: 2.5mm; Height - Seated (Max): 0.106inch; Depth: 2.7mm; Radiation Hardening: No; REACH SVHC: No SVHC; Military Standard: Not; RoHS Compliant: Yes; ComponentLink1URL: https://datasheet.ciiva.com/4957/f3115-4957838.pdf?src-supplier=Mouser; ComponentLink1Description: https://datasheet.ciiva.com/4957/f3115-4957838.pdf?src-supplier=Mouser; ComponentLink2URL: https://datasheet.ciiva.com/6691/f3115-6691487.pdf?src-supplier=Digi-Key; ComponentLink2Description: https://datasheet.ciiva.com/6691/f3115-6691487.pdf?src-supplier=Digi-Key; ComponentLink3URL: https://datasheet.ciiva.com/8512/f3115-8512543.pdf?src-supplier=Avnet; ComponentLink3Description: https://datasheet.ciiva.com/8512/f3115-8512543.pdf?src-supplier=Avnet; ComponentLink4URL: https://datasheet.ciiva.com/17280/f3115-17280270.pdf?src-supplier=Avnet+Europe; ComponentLink4Description: https://datasheet.ciiva.com/17280/f3115-17280270.pdf?src-supplier=Avnet+Europe; ComponentLink5URL: https://datasheet.ciiva.com/22685/27262-22685038.pdf?src-supplier=Element14; ComponentLink5Description: https://datasheet.ciiva.com/22685/27262-22685038.pdf?src-supplier=Element14; Supplier Part Number 1: 399-9598-1-ND
R1 R2 R5 R12 R13 R18 R22 R31 R32 = RC0805FR-0710KL: Res SMD 0805 10K 1% 0.125W T.C.100PPM; Manufacturer: Yageo; Resistance: 10kR; Temperature Coefficient: 100ppm/°C; Power Rating: 125mW; Voltage Rating: 150V; Supplier 1: Digi-Key; Manufacturer Part Number: RC0805FR-0710KL; RoHS: Yes; Category: Chip SMD Resistors; Stock 1: 1849576; Pricing 1: 5000=0.00544 (USD); Case/Package: 0805; Case Code (Imperial): 0805; Case Code (Metric): 2012; Size Code: 0805; Min Operating Temperature: -55°C; Max Operating Temperature: 155°C; Tolerance: 1%; Resistor Type: Thick Film; Packaging: Tape and Reel; Package Quantity: 1; Termination: SMD/SMT; Number of Terminations: 2; Max Power Dissipation: 125mW; Features: Moisture Resistant; Series: RC; Construction: Rectangular; Resistance Tolerance: 1%; Technology: THICK FILM; Length: 2mm; Width: 0.049inch; Height: 0.024inch; Depth: 1.25mm; REACH SVHC: Unknown; Lead Free: Lead Free; Military Standard: Not; RoHS Compliant: Yes; Supplier Part Number 1: 311-10.0KCRTR-ND
R3 = RC0805JR-074K7L: Res Thick Film 0805 4.7K Ohm 5% 0.125W(1/8W) ±100ppm/C Pad SMD T/R; Manufacturer: Yageo; Resistance: 4.7kR; Temperature Coefficient: 100ppm/°C; Power Rating: 125mW; Voltage Rating: 150V; Supplier 1: RSComponents; Manufacturer Part Number: RC0805JR-074K7L; RoHS: Yes; Category: Chip SMD Resistors; Stock 1: 17500; Pricing 1: 100=0.01400, 1000=0.01300, 2500=0.01200, 5000=0.01100, 10000=0.01000 (GBP); Case/Package: 0805; Contact Plating: Tin,Lead; Case Code (Imperial): 0805; Case Code (Metric): 2012; Size Code: 0805; Min Operating Temperature: -55°C; Max Operating Temperature: 155°C; Tolerance: 5%; Resistor Type: Thick Film; Packaging: Tape and Reel; Termination: SMD/SMT; Features: Moisture Resistant; Series: RC; Max Power Dissipation: 125mW; Number of Terminations: 2; Resistance Tolerance: 5%; Construction: Rectangular; Length: 2mm; Depth: 1.25mm; Radiation Hardening: No; Reach SVHC Compliant: Yes; Lead Free: Lead Free; Military Standard: Not; RoHS Compliant: Yes; ComponentLink1URL: https://datasheet.ciiva.com/12667/rc0805-12667037.pdf?src-supplier=Mouser; ComponentLink1Description: https://datasheet.ciiva.com/12667/rc0805-12667037.pdf?src-supplier=Mouser; ComponentLink2URL: https://datasheet.ciiva.com/7941/442941-7941974.pdf?src-supplier=Element14; ComponentLink2Description: https://datasheet.ciiva.com/7941/442941-7941974.pdf?src-supplier=Element14; ComponentLink3URL: https://datasheet.ciiva.com/7941/442941-7941973.pdf?src-supplier=Element14; ComponentLink3Description: https://datasheet.ciiva.com/7941/442941-7941973.pdf?src-supplier=Element14; ComponentLink4URL: https://datasheet.ciiva.com/17486/rc0805-17486827.pdf?src-supplier=Future+Electronics; ComponentLink4Description: https://datasheet.ciiva.com/17486/rc0805-17486827.pdf?src-supplier=Future+Electronics
R4 = RC0805JR-0747KL: Res Thick Film 0805 47K Ohm 5% 1/8W Ý100ppm/ÝC SMD Paper T/R; Manufacturer: Yageo; Resistance: 47kR; Temperature Coefficient: 100ppm/°C; Power Rating: 125mW; Voltage Rating: 150V; Supplier 1: Arrow Electronics; Manufacturer Part Number: RC0805JR-0747KL; RoHS: Yes; Category: Chip SMD Resistors; Stock 1: 6; Pricing 1: 1=0.03350 (USD); Case/Package: 0805; Contact Plating: Tin,Lead; Case Code (Imperial): 0805; Case Code (Metric): 2012; Size Code: 0805; Min Operating Temperature: -55°C; Max Operating Temperature: 155°C; Tolerance: 5%; Resistor Type: Thick Film; Packaging: Tape and Reel; Termination: SMD/SMT; Features: Moisture Resistant; Series: RC; Max Power Dissipation: 125mW; Number of Terminations: 2; Resistance Tolerance: 5%; Construction: Rectangular; Length: 2mm; Depth: 1.25mm; Radiation Hardening: No; Military Standard: Not; Lead Free: Lead Free; RoHS Compliant: Yes; ComponentLink1URL: https://datasheet.ciiva.com/7941/442941-7941967.pdf?src-supplier=Element14; ComponentLink1Description: https://datasheet.ciiva.com/7941/442941-7941967.pdf?src-supplier=Element14; ComponentLink2URL: https://datasheet.ciiva.com/17200/rc0805-17200744.pdf?src-supplier=Future+Electronics; ComponentLink2Description: https://datasheet.ciiva.com/17200/rc0805-17200744.pdf?src-supplier=Future+Electronics
R6 R7 R29 R30 = RMCF0805JT680R: Res Thick Film 0805 680 Ohm 5% 0.125W(1/8W) ±200ppm/C Pad SMD Automotive T/R; Manufacturer: Stackpole Electronics; Resistance: 680R; Max Power Dissipation: 125mW; Temperature Coefficient: 200ppm/°C; Manufacturer Part Number: RMCF0805JT680R; RoHS: Yes; Category: Chip SMD Resistors; Stock 1: 436918; Pricing 1: 1=0.10000, 10=0.01800, 100=0.00750, 1000=0.00337, 2500=0.00292 (USD); Mount: Surface Mount; Case/Package: 0805; Case Code (Metric): 2012; Case Code (Imperial): 0805; Contact Plating: Tin,Matte; Min Operating Temperature: -55°C; Max Operating Temperature: 155°C; Tolerance: 5%; Packaging: Tape and Reel; Resistor Type: Thick Film; Number of Terminations: 2; Features: Automotive AEC-Q200; Series: RMCF; Construction: Rectangular; Length: 2mm; Width: 0.049inch; Height: 0.026inch; Depth: 1.25mm; Radiation Hardening: No; Military Standard: Not; Lead Free: Lead Free; RoHS Compliant: Yes; ComponentLink1URL: https://datasheet.ciiva.com/15193/getdatasheetpartid-462682-15193655.pdf?src-supplier=Verical; ComponentLink1Description: https://datasheet.ciiva.com/15193/getdatasheetpartid-462682-15193655.pdf?src-supplier=Verical; Supplier 1: Digi-Key; Supplier Part Number 1: RMCF0805JT680RCT-ND
R8 = RC0805FR-071K2L: Res Thick Film 0805 1.2K Ohm 1% 0.125W(1/8W) ±100ppm/C Pad SMD T/R; Manufacturer: Yageo; Resistance: 1.2kR; Temperature Coefficient: 100ppm/°C; Voltage Rating: 150V; Power Rating: 125mW; Manufacturer Part Number: RC0805FR-071K2L; RoHS: Yes; Category: Chip SMD Resistors; Stock 1: 795; Pricing 1: 1=0.10000, 10=0.02900, 50=0.02900, 100=0.01400, 1000=0.00600, 10000=0.00300 (USD); Case/Package: 0805; Case Code (Imperial): 0805; Case Code (Metric): 2012; Min Operating Temperature: -55°C; Max Operating Temperature: 155°C; Tolerance: 1%; Resistor Type: Thick Film; Packaging: Tape and Reel; Package Quantity: 1; Termination: SMD/SMT; Number of Terminations: 2; Max Power Dissipation: 125mW; Working Voltage: 150V; Features: Moisture Resistant; Series: RC; Resistance Tolerance: 1%; Technology: THICK FILM; Construction: Rectangular; Length: 0.079inch; Width: 0.049inch; Height: 0.024inch; Depth: 1.25mm; Lead Free: Lead Free; Military Standard: Not; RoHS Compliant: Yes; ComponentLink1URL: https://datasheet.ciiva.com/11808/0900766b8106beab-11808865.pdf?src-supplier=RSComponents; ComponentLink1Description: https://datasheet.ciiva.com/11808/0900766b8106beab-11808865.pdf?src-supplier=RSComponents; ComponentLink2URL: https://datasheet.ciiva.com/2457/pyu-r-int-thick-7-2457192.pdf?src-supplier=Digi-Key; ComponentLink2Description: https://datasheet.ciiva.com/2457/pyu-r-int-thick-7-2457192.pdf?src-supplier=Digi-Key; ComponentLink3URL: https://datasheet.ciiva.com/2457/pyu-r-int-thick-7-2457193.pdf?src-supplier=Digi-Key; ComponentLink3Description: https://datasheet.ciiva.com/2457/pyu-r-int-thick-7-2457193.pdf?src-supplier=Digi-Key; ComponentLink4URL: https://datasheet.ciiva.com/2457/pyu-r-int-thick-7-2457191.pdf?src-supplier=Digi-Key; ComponentLink4Description: https://datasheet.ciiva.com/2457/pyu-r-int-thick-7-2457191.pdf?src-supplier=Digi-Key; ComponentLink5URL: https://datasheet.ciiva.com/12656/rc0805-12656886.pdf?src-supplier=Mouser; ComponentLink5Description: https://datasheet.ciiva.com/12656/rc0805-12656886.pdf?src-supplier=Mouser; ComponentLink6URL: https://datasheet.ciiva.com/15189/getdatasheetpartid-348582-15189915.pdf?src-supplier=Verical; ComponentLink6Description: https://datasheet.ciiva.com/15189/getdatasheetpartid-348582-15189915.pdf?src-supplier=Verical; Supplier 1: Mouser; Supplier Part Number 1: 603-RC0805FR-071K2L
R9 R10 R15 = RC0805FR-071KL: Res Thick Film 0805 1KOhm 1% 0.125W(1/8W) 100ppm/C Epoxy Pad SMD T/R; Manufacturer: Yageo; Resistance: 1kR; Temperature Coefficient: 100ppm/°C; Voltage Rating (DC): 150V; Power Rating: 125mW; Supplier 1: Digi-Key; Manufacturer Part Number: RC0805FR-071KL; RoHS: Yes; Category: Chip SMD Resistors; Stock 1: 5664551; Pricing 1: 5000=0.00544 (USD); Case/Package: 0805; Number of Pins: 2; Case Code (Metric): 2012; Case Code (Imperial): 0805; Size Code: 0805; Min Operating Temperature: -55°C; Max Operating Temperature: 155°C; Tolerance: 1%; Packaging: Tape and Reel; Resistor Type: Thick Film; Package Quantity: 1; Voltage Rating: 150V; Number of Terminations: 2; Termination: SMD/SMT; Max Power Dissipation: 125mW; Features: Moisture Resistant; Series: RC; Resistance Tolerance: 1%; Construction: Rectangular; Length: 0.079inch; Width: 0.049inch; Height: 0.024inch; Depth: 1.25mm; REACH SVHC: Unknown; Lead Free: Lead Free; RoHS Compliant: Yes; Military Standard: Not; Supplier Part Number 1: 311-1.00KCRTR-ND
R11 R16 R17 = RC0805FR-07560RL: Res General Purpose Thick Film 0805 560 Ohm 1% 1/8W ±100ppm/°C Molded Paper T/R; Manufacturer: Yageo; Resistance: 560R; Power Rating: 125mW; Voltage Rating: 150V; Supplier 1: Digi-Key; Manufacturer Part Number: RC0805FR-07560RL; RoHS: Yes; Category: Chip SMD Resistors; Stock 1: 450592; Pricing 1: 1=0.10000, 10=0.04200, 100=0.01690, 1000=0.00759, 2500=0.00659 (USD); Case/Package: 0805; Case Code (Metric): 2012; Case Code (Imperial): 0805; Weight: 0.000194oz; Size Code: 0805; Min Operating Temperature: -55°C; Max Operating Temperature: 155°C; Tolerance: 1%; Packaging: Tape and Reel; Resistor Type: Thick Film; Temperature Coefficient: 100ppm/°C; Package Quantity: 1; Number of Terminations: 2; Termination: SMD/SMT; Max Power Dissipation: 125mW; Features: Moisture Resistant; Series: RC; Resistance Tolerance: 1%; Construction: Rectangular; Length: 2mm; Width: 0.049inch; Height: 0.024inch; Depth: 1.25mm; REACH SVHC: Unknown; Lead Free: Lead Free; RoHS Compliant: Yes; Military Standard: Not; Supplier Part Number 1: 311-560CRCT-ND